# Altium schematic sheet STM32F407VG_B.SchDoc
size A4; SheetNumber: 4; SheetTotal: 8
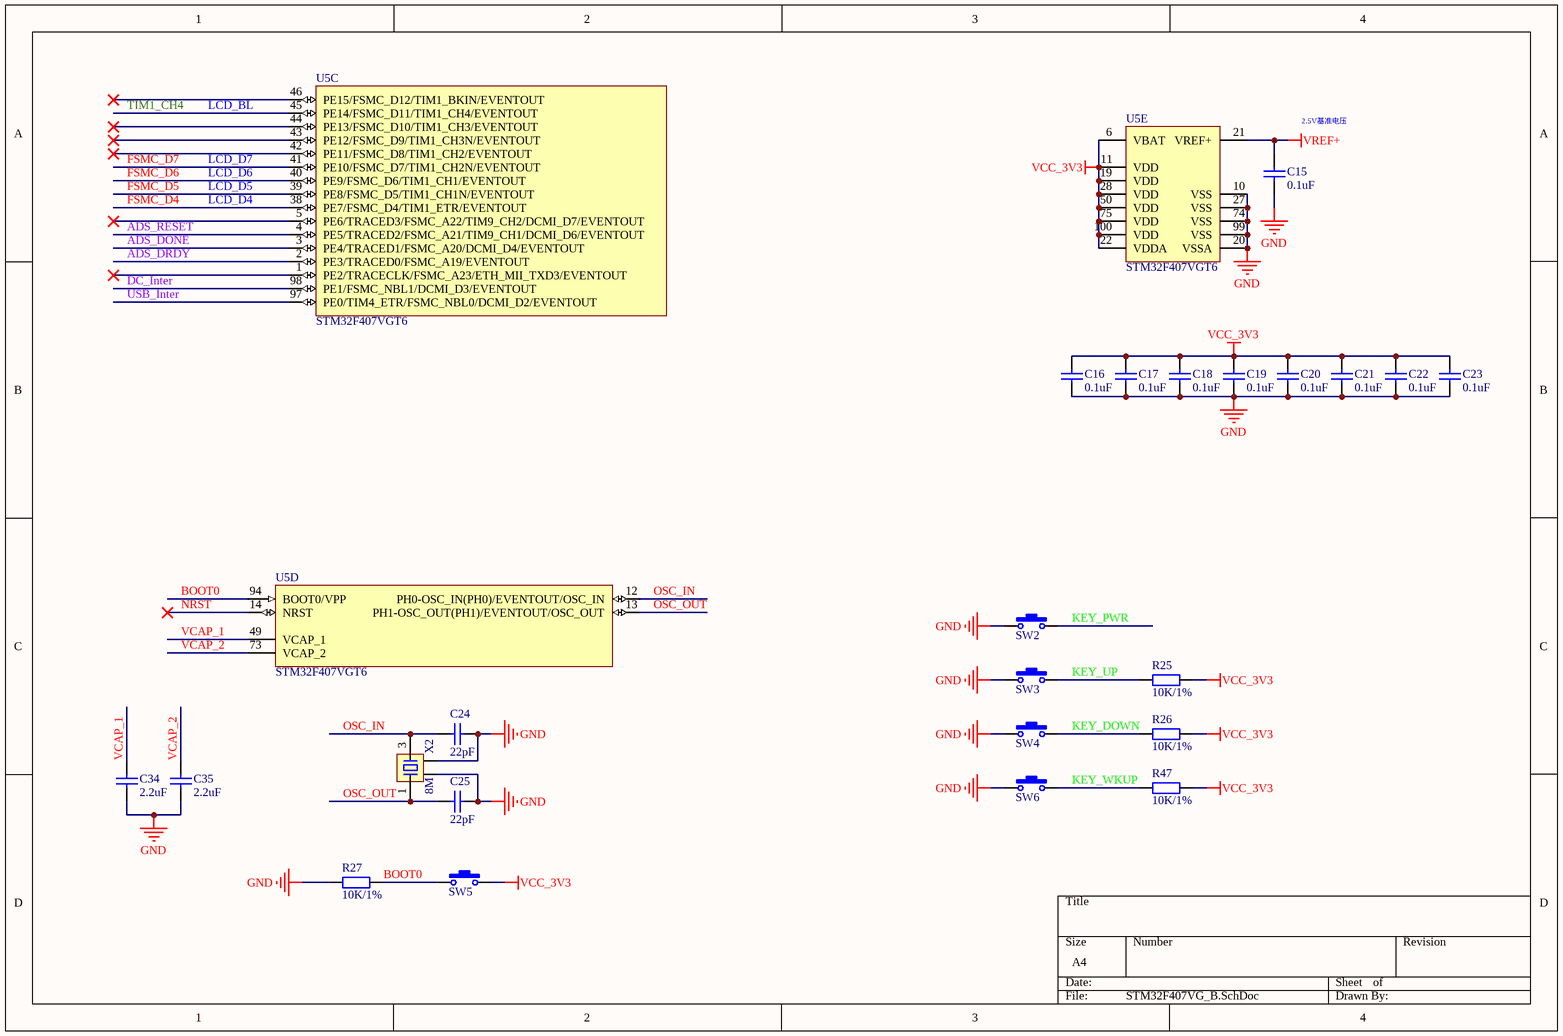
[diagram p0: STM32F407VG_B.SchDoc]

## Parts
C15  0.1uF  [C0402_L]
C16  0.1uF  [C0402_L]
C17  0.1uF  [C0402_L]
C18  0.1uF  [C0402_L]
C19  0.1uF  [C0402_L]
C20  0.1uF  [C0402_L]
C21  0.1uF  [C0402_L]
C22  0.1uF  [C0402_L]
C23  0.1uF  [C0402_L]
C24  22pF  [C0402_L]
C25  22pF  [C0402_L]
C34  2.2uF  [C0402_L]
C35  2.2uF  [C0402_L]
R25  10K/1%  [R0402_L]
R26  10K/1%  [R0402_L]
R27  10K/1%  [R0402_L]
R47  10K/1%  [R0402_L]
SW2  小龟按键  [2*4*3.5]  (value not drawn)
SW3  小龟按键  [2*4*3.5]  (value not drawn)
SW4  小龟按键  [2*4*3.5]  (value not drawn)
SW5  小龟按键  [3*4两脚小龟按键]  (value not drawn)
SW6  小龟按键  [2*4*3.5]  (value not drawn)
U5  STM32F407VGT6  [LQFP100_L]  (parts C,D,E of 5)
X2  8M  [XTAL-3225-4P]

## Nets
GND: C15.1 C16.1 C17.1 C18.1 C19.1 C20.1 C21.1 C22.1 C23.1 C24.2 C25.2 C34.1 C35.1 R27.1 SW2.1 SW3.1 SW4.1 SW6.1 U5.10(VSS) U5.20(VSSA) U5.27(VSS) U5.74(VSS) U5.99(VSS) X2.2 X2.4
VCC_3V3: C16.2 C17.2 C18.2 C19.2 C20.2 C21.2 C22.2 C23.2 R25.2 R26.2 R47.2 SW5.2 U5.6(VBAT) U5.11(VDD) U5.19(VDD) U5.22(VDDA) U5.28(VDD) U5.50(VDD) U5.75(VDD) U5.100(VDD)
VREF+: C15.2 U5.21(VREF+)
ADS_DONE: U5.3(PE4/TRACED1/FSMC_A20/DCMI_D4/EVENTOUT)
ADS_DRDY: U5.2(PE3/TRACED0/FSMC_A19/EVENTOUT)
ADS_RESET: U5.4(PE5/TRACED2/FSMC_A21/TIM9_CH1/DCMI_D6/EVENTOUT)
BOOT0: R27.2 SW5.1 U5.94(BOOT0/VPP)
DC_Inter: U5.98(PE1/FSMC_NBL1/DCMI_D3/EVENTOUT)
FSMC_D4: U5.38(PE7/FSMC_D4/TIM1_ETR/EVENTOUT)  [also labelled LCD_D4]
FSMC_D5: U5.39(PE8/FSMC_D5/TIM1_CH1N/EVENTOUT)  [also labelled LCD_D5]
FSMC_D6: U5.40(PE9/FSMC_D6/TIM1_CH1/EVENTOUT)  [also labelled LCD_D6]
FSMC_D7: U5.41(PE10/FSMC_D7/TIM1_CH2N/EVENTOUT)  [also labelled LCD_D7]
KEY_DOWN: R26.1 SW4.2
KEY_PWR: SW2.2
KEY_UP: R25.1 SW3.2
KEY_WKUP: R47.1 SW6.2
LCD_BL: U5.45(PE14/FSMC_D11/TIM1_CH4/EVENTOUT)  [also labelled TIM1_CH4]
NRST: U5.14(NRST)
OSC_IN: C24.1 U5.12(PH0-OSC_IN(PH0)/EVENTOUT/OSC_IN) X2.3
OSC_OUT: C25.1 U5.13(PH1-OSC_OUT(PH1)/EVENTOUT/OSC_OUT) X2.1
USB_Inter: U5.97(PE0/TIM4_ETR/FSMC_NBL0/DCMI_D2/EVENTOUT)
VCAP_1: C34.2 U5.49(VCAP_1)
VCAP_2: C35.2 U5.73(VCAP_2)

Not connected (* = marked no-connect by the designer): U5 1(PE2/TRACECLK/FSMC_A23/ETH_MII_TXD3/EVENTOUT)* 5(PE6/TRACED3/FSMC_A22/TIM9_CH2/DCMI_D7/EVENTOUT)* 42(PE11/FSMC_D8/TIM1_CH2/EVENTOUT)* 43(PE12/FSMC_D9/TIM1_CH3N/EVENTOUT)* 44(PE13/FSMC_D10/TIM1_CH3/EVENTOUT)* 46(PE15/FSMC_D12/TIM1_BKIN/EVENTOUT)*

## Notes on the sheet
- (near C15) 2.5V基准电压

## Library data of the parts
C15-C25 C34 C35 = C: 贴片电容; BOM名称: 无极性贴片电容; 联系卖家，免费查找封装: 唯一出售店铺网址https://shop463601444.taobao.com
R25-R27 R47 = R: 贴片电阻; 联系卖家，免费查找封装: 唯一出售店铺网址https://shop463601444.taobao.com; BOM名称: 贴片电阻
SW2-SW6 = SW-PB: 微动开关; BOM名称: 3x6轻触开关; 联系卖家，免费查找封装: 唯一出售店铺网址https://shop463601444.taobao.com; 封装库来自淘宝卖家ID：黄晶宝石: 其他店铺购入均为盗版假冒封装库，请立即申请退款
U5 = STM32F407VGT6: ARM Cortex-M4 32b MCU+FPU, 210DMIP, 1024 kB Flash, 192+4 kB RAM, Camera, 82 I/Os, 100-pin LQFP, -40 to +85癈, Tray; Internal RAM: 192kB; Operating Frequency (Processor Speed): 168MHz; A/D Converter: 16x12-bit; D/A Converter: 2x12-bit; 16-bit Timers (IC/OC/PWM): 12x16-bit(24/24/30); 32-bit Timer (IC/OC/PWM): 2x32-bit (8/8/8); Other Timer Functions: 2xWDG, RTC, 24-bit down counter; Serial Interface: 3xSPI/2xI2S/2xI2C/3xUSART(IrDa, ISO7816)/3xUART/2xUSB OTG FS/HS, 2xCAN/Ethernet MAC10/100, SDIO; 联系卖家，免费查找封装: 唯一出售店铺网址https://shop463601444.taobao.com; DatasheetVersion: rev2, Jan-2012; PackageVersion: 2012; PackageReference: LQFP100; PackageDescription: 100-Pin Low Profile Quad Flat Package, 14x14 mm Body, 0.5 mm Pitch; ComponentLink1Description: Manufacturer URL; ComponentLink1URL: http://www.st.com/; ComponentLink2Description: STM32F405/7 Datasheet; ComponentLink2URL: http://www.st.com/internet/com/TECHNICAL_RESOURCES/TECHNICAL_LITERATURE/DATASHEET/DM00037051.pdf; ComponentLink3Description: STM32F4 Web Page; ComponentLink3URL: http://www.st.com/internet/mcu/subclass/1521.jsp
X2 = XTAL-4P: 4脚无源晶振(谐振器）; 联系卖家，免费查找封装: 唯一出售店铺网址https://shop463601444.taobao.com; BOM名称: 4脚无源晶振(谐振器）